# Altium schematic sheet Sheet2.SchDoc
size A4
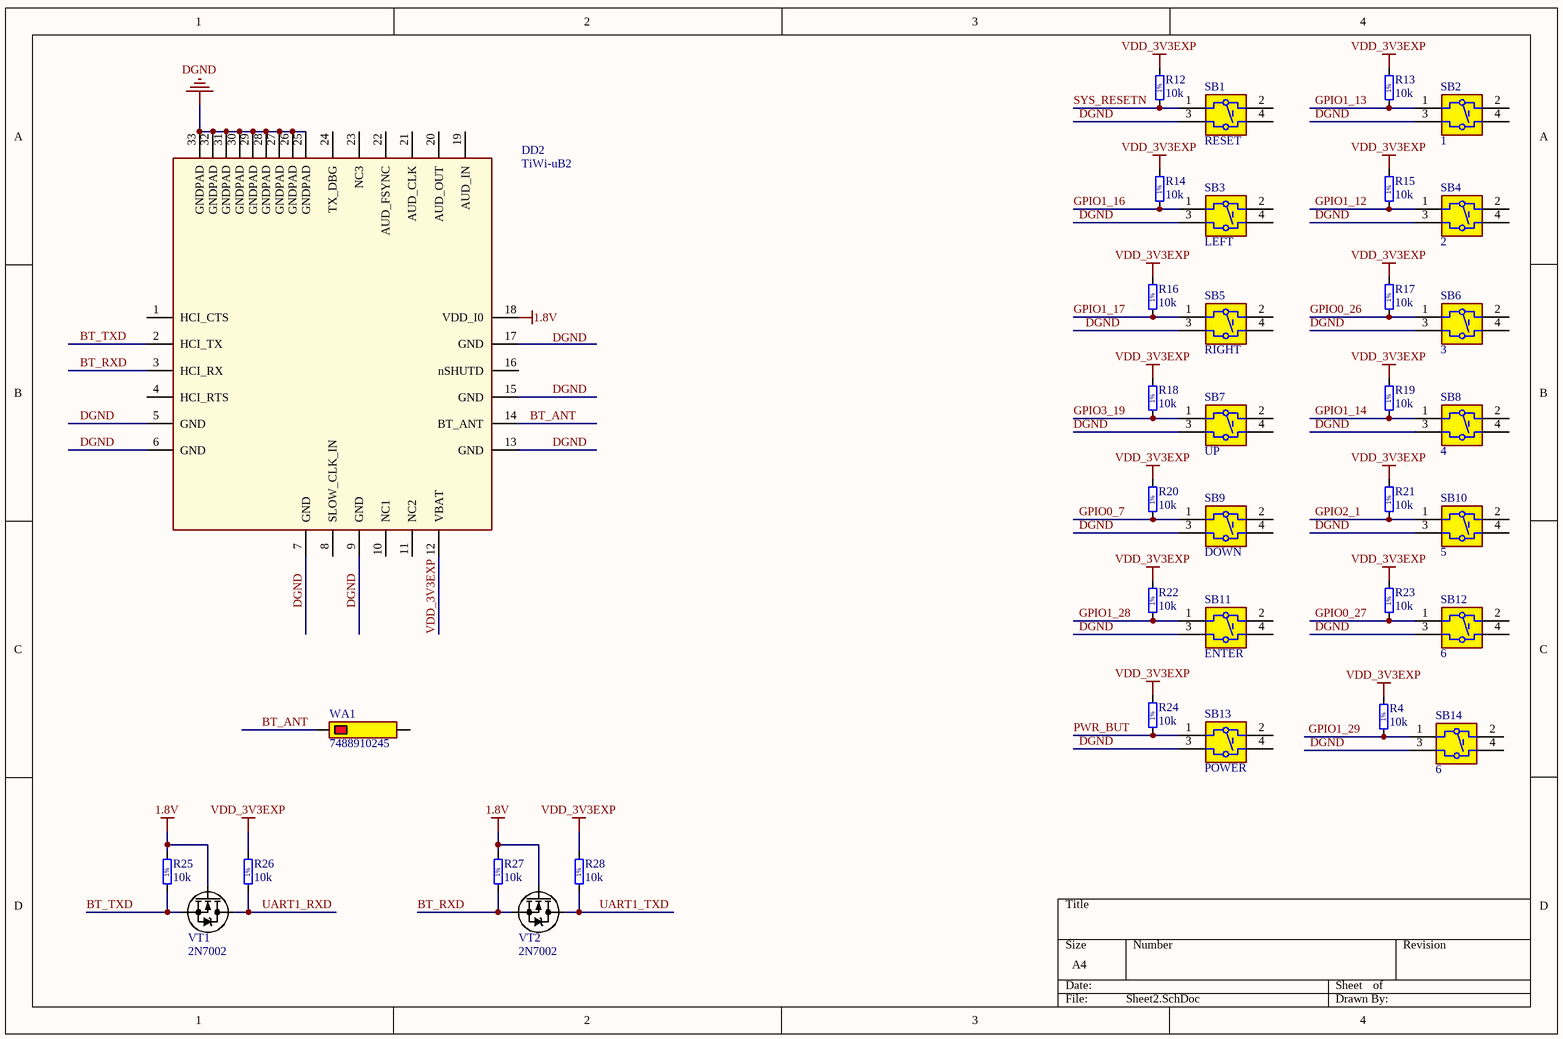
[diagram p0: Sheet2.SchDoc]

## Parts
DD2  TiWi-uB2  [TiWi-uB2]
R4  10k  [RES0603R]
R12  10k  [RES0603R]
R13  10k  [RES0603R]
R14  10k  [RES0603R]
R15  10k  [RES0603R]
R16  10k  [RES0603R]
R17  10k  [RES0603R]
R18  10k  [RES0603R]
R19  10k  [RES0603R]
R20  10k  [RES0603R]
R21  10k  [RES0603R]
R22  10k  [RES0603R]
R23  10k  [RES0603R]
R24  10k  [RES0603R]
R25  10k  [RES0603R]
R26  10k  [RES0603R]
R27  10k  [RES0603R]
R28  10k  [RES0603R]
SB1  RESET  [DTSMW-3.8N]
SB2  1  [DTSMW-3.8N]
SB3  LEFT  [DTSMW-3.8N]
SB4  2  [DTSMW-3.8N]
SB5  RIGHT  [DTSMW-3.8N]
SB6  3  [DTSMW-3.8N]
SB7  UP  [DTSMW-3.8N]
SB8  4  [DTSMW-3.8N]
SB9  DOWN  [DTSMW-3.8N]
SB10  5  [DTSMW-3.8N]
SB11  ENTER  [DTSMW-3.8N]
SB12  6  [DTSMW-3.8N]
SB13  POWER  [DTSMW-3.8N]
SB14  6  [DTSMW-3.8N]
VT1  2N7002  [SOT23]
VT2  2N7002  [SOT23]
WA1  7488910245  [7488910245]

## Nets
1.8V: DD2.18(VDD_I0) R25.2 R27.2 VT1.1(G) VT2.1(G)
DGND: DD2.5(GND) DD2.6(GND) DD2.7(GND) DD2.9(GND) DD2.13(GND) DD2.15(GND) DD2.25(GNDPAD) DD2.26(GNDPAD) DD2.27(GNDPAD) DD2.28(GNDPAD) DD2.29(GNDPAD) DD2.30(GNDPAD) DD2.31(GNDPAD) DD2.32(GNDPAD) DD2.33(GNDPAD) SB1.3(T3) SB2.3(T3) SB3.3(T3) SB4.3(T3) SB5.3(T3) SB6.3(T3) SB7.3(T3) SB8.3(T3) SB9.3(T3) SB10.3(T3) SB11.3(T3) SB12.3(T3) SB13.3(T3) SB14.3(T3)
VDD_3V3EXP: DD2.12(VBAT) R4.2 R12.2 R13.2 R14.2 R15.2 R16.2 R17.2 R18.2 R19.2 R20.2 R21.2 R22.2 R23.2 R24.2 R26.2 R28.2
BT_ANT: DD2.14(BT_ANT) WA1.1
BT_RXD: DD2.3(HCI_RX) R27.1 VT2.2(S)
BT_TXD: DD2.2(HCI_TX) R25.1 VT1.2(S)
GPIO0_7: R20.1 SB9.1(T1)
GPIO0_26: R17.1 SB6.1(T1)
GPIO0_27: R23.1 SB12.1(T1)
GPIO1_12: R15.1 SB4.1(T1)
GPIO1_13: R13.1 SB2.1(T1)
GPIO1_14: R19.1 SB8.1(T1)
GPIO1_16: R14.1 SB3.1(T1)
GPIO1_17: R16.1 SB5.1(T1)
GPIO1_28: R22.1 SB11.1(T1)
GPIO1_29: R4.1 SB14.1(T1)
GPIO2_1: R21.1 SB10.1(T1)
GPIO3_19: R18.1 SB7.1(T1)
PWR_BUT: R24.1 SB13.1(T1)
SYS_RESETN: R12.1 SB1.1(T1)
UART1_RXD: R26.1 VT1.3(D)
UART1_TXD: R28.1 VT2.3(D)

Not connected (* = marked no-connect by the designer): DD2 1(HCI_CTS) 4(HCI_RTS) 8(SLOW_CLK_IN) 10(NC1) 11(NC2) 16(nSHUTD) 17(GND) 19(AUD_IN) 20(AUD_OUT) 21(AUD_CLK) 22(AUD_FSYNC) 23(NC3) 24(TX_DBG); SB1 2(T2) 4(T3); SB2 2(T2) 4(T3); SB3 2(T2) 4(T3); SB4 2(T2) 4(T3); SB5 2(T2) 4(T3); SB6 2(T2) 4(T3); SB7 2(T2) 4(T3); SB8 2(T2) 4(T3); SB9 2(T2) 4(T3); SB10 2(T2) 4(T3); SB11 2(T2) 4(T3); SB12 2(T2) 4(T3); SB13 2(T2) 4(T3); SB14 2(T2) 4(T3); WA1 2

## Notes on the sheet
- Labels drawn without touching a wire or pin: DGND
- (in symbol R0603_10K_1%_0.1W_100PPM) 1%

## Library data of the parts
R4 R12-R28 = R0603_10K_1%_0.1W_100PPM: Part Description: General Purpose Thick Film Chip Resistor; Manufacturer: GENERIC; Manufacturer1 Part Number: NRC06F1002TRF; Power: 0.1W; TC: ±100ppm/°C; Tolerance: ±1%; Table: Resistors SMD; Part Number: R0603_10K_1%_0.1W_100PPM; Component Kind: Standard; Component Type: Standard; Footprint: RESC1608X55N; Pin Count: 2; Value: 10k; Status: Preferred; Manufacturer Part Number: R0603_10K_1%_0.1W_100PPM; Case: 0603; Mounted: Yes; Socket: No; SMD: Yes; Manufacturer1 Example: NIC COMPONENT; Manufacturer1 ComponentHeight: 0.55mm; HelpURL: \\cern.ch\dfs\Applications\Altium\Datasheets\R0603_NIC_NRC.pdf; Author: CERN DEM JLC; CreateDate: 03.12.2007; LatestRevisionDate: 13.03.2008
SB1-SB14 = DTSMW-3.8N: Table: Button; Part Number: DTSMW-3.8N; Device: DTSMW-3.8N
VT1 VT2 = 2N7002: N-Channel Enhancement Mode FET; Part Description: MOSFET N-канал 60В/0.4А(пост.ток)/2.0А(импульсн.), встроенный диод; Table: Transistors; Part Number: 2N7002; Component Kind: Standard; Component Type: Standard; Device: 2N7002; Status: Active; Case: SOT23; Mounted: Yes; Socket: No; SMD: Yes; Author: I. Kuznetsov
WA1 = 7488910245: Bluetooth Antenna; Part Description: SMD Antenne WE-MCA; Manufacturer: Wurth Elektronik; Table: Power; Part Number: 7488910245; Component Kind: Standard; Component Type: Standard; Device: 7488910245; Manufacturer Part Number: 7488910245; Pin Count: 2; Case: 7488910245; Socket: No; SMD: Yes; ComponentHeight: 3.68; Author: I. Kuznetsov